# Altium project MeteoStation.PrjPcb
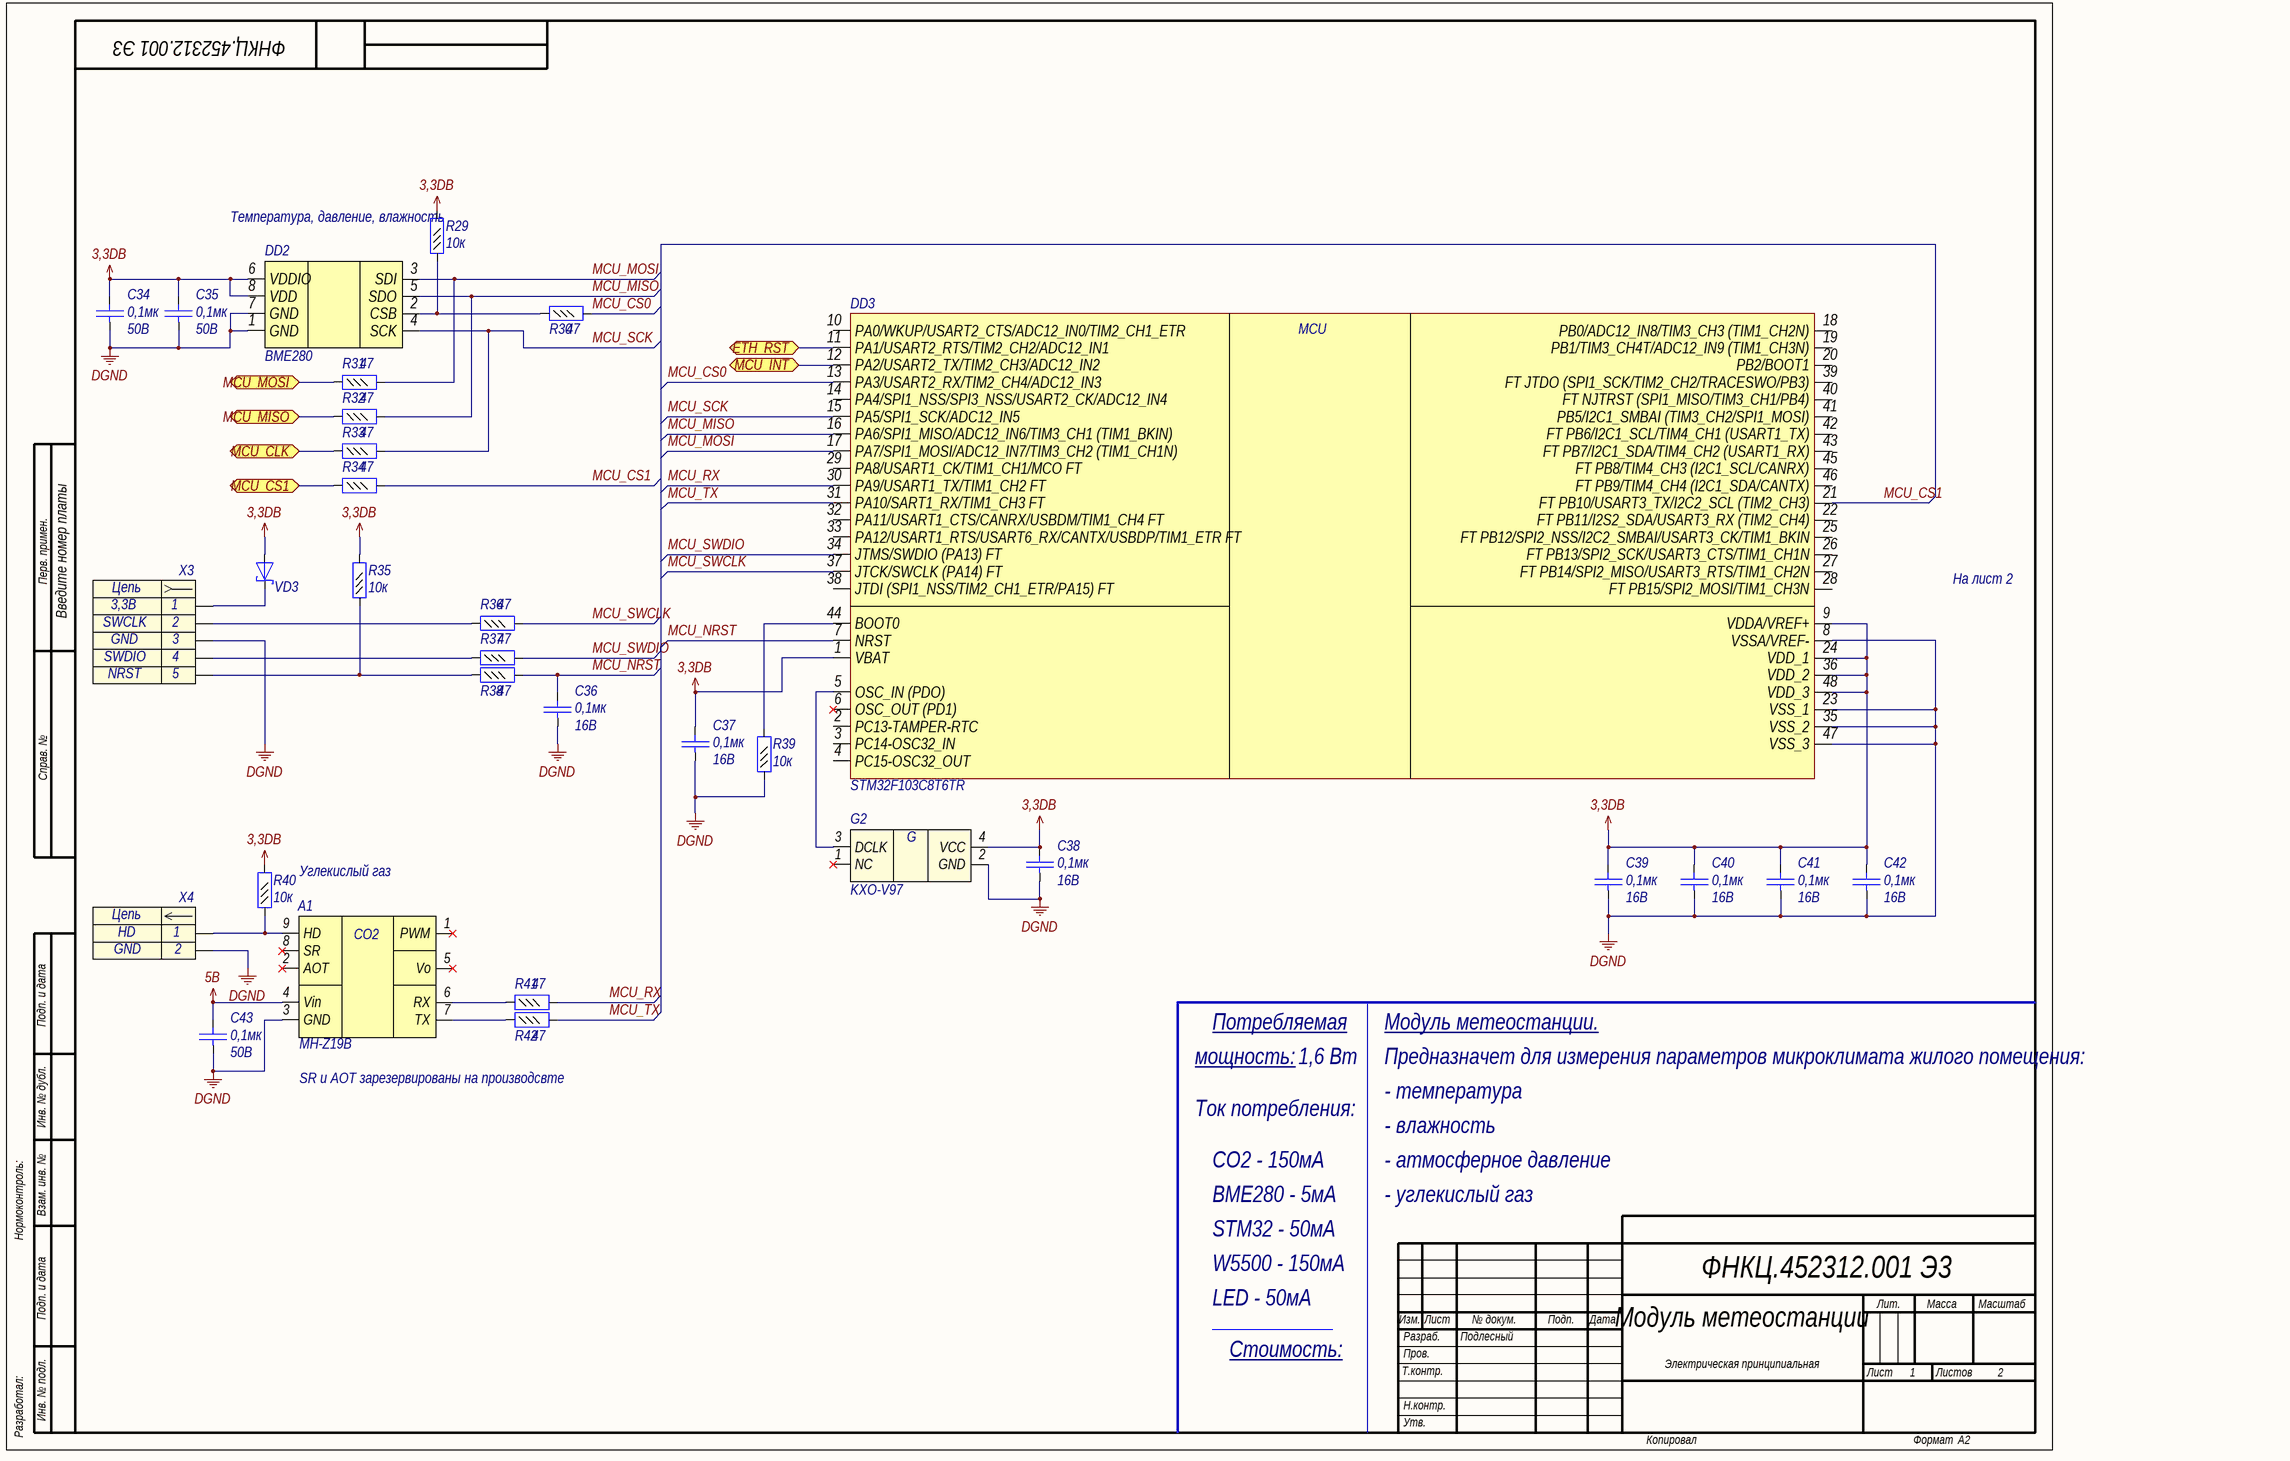
[diagram p0: MeteoStation_MCU.SchDoc]
2 sheets, 108 parts. Net scope: flat (ports and power ports of the same name join across sheets).
Board file: MeteoStation.PcbDoc
Sheets:
  MeteoStation_MCU.SchDoc
  MeteoStation_ETH.SchDoc

## Sheet MeteoStation_MCU.SchDoc: Модуль метеостанции
size 594 x 420 mm; DrawnBy: Подлесный; DocumentNumber: ФНКЦ.452312.001 Э3; SheetNumber: 1; SheetTotal: 2; Format: A2; DocumentType: Электрическая принципиальная; ImagePath: Введите номер платы

### Parts
A1  MH-Z19B  [MH-Z19B]
C34  value 0,1мк  Voltage: 50B  [C0603]  (hidden comment: Capacitor)
C35  value 0,1мк  Voltage: 50B  [C0603]  (hidden comment: Capacitor)
C36  value 0,1мк  Voltage: 16B  [C0402]  (hidden comment: Capacitor)
C37  value 0,1мк  Voltage: 16B  [C0402]  (hidden comment: Capacitor)
C38  value 0,1мк  Voltage: 16B  [C0402]  (hidden comment: Capacitor)
C39  value 0,1мк  Voltage: 16B  [C0402]  (hidden comment: Capacitor)
C40  value 0,1мк  Voltage: 16B  [C0402]  (hidden comment: Capacitor)
C41  value 0,1мк  Voltage: 16B  [C0402]  (hidden comment: Capacitor)
C42  value 0,1мк  Voltage: 16B  [C0402]  (hidden comment: Capacitor)
C43  value 0,1мк  Voltage: 50B  [C0603]  (hidden comment: Capacitor)
DD2  BME280  [BME280]
DD3  STM32F103C8T6TR  [LQFP48]
G2  Part Number: KXO-V97  [QSMD7x5.2x1.8]  (hidden comment: KXO)
R29  value 10к  [R0402]  (hidden comment: Resistor_0,062Вт)
R30  value 47  [R0402]  (hidden comment: Resistor_0,062Вт)
R31  value 47  [R0402]  (hidden comment: Resistor_0,062Вт)
R32  value 47  [R0402]  (hidden comment: Resistor_0,062Вт)
R33  value 47  [R0402]  (hidden comment: Resistor_0,062Вт)
R34  value 47  [R0402]  (hidden comment: Resistor_0,062Вт)
R35  value 10к  [R0402]  (hidden comment: Resistor_0,062Вт)
R36  value 47  [R0402]  (hidden comment: Resistor_0,062Вт)
R37  value 47  [R0402]  (hidden comment: Resistor_0,062Вт)
R38  value 47  [R0402]  (hidden comment: Resistor_0,062Вт)
R39  value 10к  [R0402]  (hidden comment: Resistor_0,062Вт)
R40  value 10к  [R0402]  (hidden comment: Resistor_0,062Вт)
R41  value 47  [R0402]  (hidden comment: Resistor_0,062Вт)
R42  value 47  [R0402]  (hidden comment: Resistor_0,062Вт)
VD3  DiodeSchottky  [SOD-323]  (value not drawn)
X3  Header_5_sct  [53047-0510]  (value not drawn)
X4  (no value)  [JUMPER_2.54]

### Ports
ETH_RST, MCU_CLK, MCU_CS1, MCU_INT, MCU_MISO, MCU_MOSI

### Nets
3,3DB: C34.2 C35.2 C37.2 C38.2 C39.2 C40.2 C41.2 C42.2 DD2.6(VDDIO) DD2.8(VDD) DD3.1(VBAT) DD3.9(VDDA/VREF+) DD3.24(VDD_1) DD3.36(VDD_2) DD3.48(VDD_3) G2.4(VCC) R29.2 R35.2 R40.2 VD3.2(A)
5B: A1.4(Vin) C43.2
DGND: A1.3(GND) C34.1 C35.1 C36.1 C37.1 C38.1 C39.1 C40.1 C41.1 C42.1 C43.1 DD2.1(GND) DD2.7(GND) DD3.8(VSSA/VREF-) DD3.23(VSS_1) DD3.35(VSS_2) DD3.47(VSS_3) G2.2(GND) R39.1 X3.3 X4.2
MCU_CS0: DD3.13(PA3/USART2_RX/TIM2_CH4/ADC12_IN3) R30.2
MCU_CS1: DD3.21(FT_PB10/USART3_TX/I2C2_SCL_(TIM2_CH3)) R34.2
MCU_MISO: DD2.5(SDO) DD3.16(PA6/SPI1_MISO/ADC12_IN6/TIM3_CH1_(TIM1_BKIN)) R32.2
MCU_MOSI: DD2.3(SDI) DD3.17(PA7/SPI1_MOSI/ADC12_IN7/TIM3_CH2_(TIM1_CH1N)) R31.2
MCU_NRST: C36.2 DD3.7(NRST) R38.2
MCU_RX: DD3.30(PA9/USART1_TX/TIM1_CH2_FT) R41.2
MCU_SCK: DD2.4(SCK) DD3.15(PA5/SPI1_SCK/ADC12_IN5) R33.2
MCU_SWCLK: DD3.37(JTCK/SWCLK_(PA14)_FT) R36.2
MCU_SWDIO: DD3.34(JTMS/SWDIO_(PA13)_FT) R37.2
MCU_TX: DD3.31(PA10/SART1_RX/TIM1_CH3_FT) R42.2
NetA1_6: A1.6(RX) R41.1
NetA1_7: A1.7(TX) R42.1
NetA1_9: A1.9(HD) R40.1 X4.1
NetDD1_32: R34.1 ; port MCU_CS1
NetDD1_33: R33.1 ; port MCU_CLK
NetDD1_34: R32.1 ; port MCU_MISO
NetDD1_35: R31.1 ; port MCU_MOSI
NetDD2_2: DD2.2(CSB) R29.1 R30.1
NetDD3_5: DD3.5(OSC_IN_(PDO)) G2.3(DCLK)
NetDD3_11: DD3.11(PA1/USART2_RTS/TIM2_CH2/ADC12_IN1) ; port ETH_RST
NetDD3_12: DD3.12(PA2/USART2_TX/TIM2_CH3/ADC12_IN2) ; port MCU_INT
NetDD3_44: DD3.44(BOOT0) R39.2
NetR35_1: R35.1 R38.1 X3.5
NetR36_1: R36.1 X3.2
NetR37_1: R37.1 X3.4
NetVD3_1: VD3.1(K) X3.1

Not connected (* = marked no-connect by the designer): A1 1(PWM)* 2(AOT)* 5(Vo)* 8(SR)*; DD3 2(PC13-TAMPER-RTC) 3(PC14-OSC32_IN) 4(PC15-OSC32_OUT) 6(OSC_OUT_(PD1))* 10(PA0/WKUP/USART2_CTS/ADC12_IN0/TIM2_CH1_ETR) 14(PA4/SPI1_NSS/SPI3_NSS/USART2_CK/ADC12_IN4) 18(PB0/ADC12_IN8/TIM3_CH3_(TIM1_CH2N)) 19(PB1/TIM3_CH4T/ADC12_IN9_(TIM1_CH3N)) 20(PB2/BOOT1) 22(FT_PB11/I2S2_SDA/USART3_RX_(TIM2_CH4)) 25(FT_PB12/SPI2_NSS/I2C2_SMBAI/USART3_CK/TIM1_BKIN) 26(FT_PB13/SPI2_SCK/USART3_CTS/TIM1_CH1N) 27(FT_PB14/SPI2_MISO/USART3_RTS/TIM1_CH2N) 28(FT_PB15/SPI2_MOSI/TIM1_CH3N) 29(PA8/USART1_CK/TIM1_CH1/MCO_FT) 32(PA11/USART1_CTS/CANRX/USBDM/TIM1_CH4_FT) 33(PA12/USART1_RTS/USART6_RX/CANTX/USBDP/TIM1_ETR_FT) 38(JTDI_(SPI1_NSS/TIM2_CH1_ETR/PA15)_FT) 39(FT_JTDO_(SPI1_SCK/TIM2_CH2/TRACESWO/PB3)) 40(FT_NJTRST_(SPI1_MISO/TIM3_CH1/PB4)) 41(PB5/I2C1_SMBAI_(TIM3_CH2/SPI1_MOSI)) 42(FT_PB6/I2C1_SCL/TIM4_CH1_(USART1_TX)) 43(FT_PB7/I2C1_SDA/TIM4_CH2_(USART1_RX)) 45(FT_PB8/TIM4_CH3_(I2C1_SCL/CANRX)) 46(FT_PB9/TIM4_CH4_(I2C1_SDA/CANTX)); G2 1(NC)*

### Notes on the sheet
- (near R29) Температура, давление, влажность
- Перв. примен.
- На лист 2
- Справ. №
- Углекислый газ
- Подп. и дата
- мощность:
- Потребляемая
- 1,6 Вт
- Модуль метеостанции.
- Предназначет для измерения параметров микроклимата жилого помещения:
- Инв. № дубл.
- SR и AOT зарезервированы на производсвте
- - температура
- Ток потребления:
- - влажность
- Нормоконтроль:
- Взам. инв. №
- СО2 - 150мА
- BME280 - 5мА
- - атмосферное давление
- - углекислый газ
- STM32 - 50мА
- W5500 - 150мА
- LED - 50мА
- Изм.
- Лист
- № докум.
- Подп.
- Дата
- Лит.
- Масса
- Масштаб
- Стоимость:
- Т.контр.
- Пров.
- Разраб.
- Листов
- Разработал:
- Инв. № подл.
- Н.контр.
- Утв.
- Копировал
- Формат
- (in symbol connect54) Цепь
- (in symbol connect55) Цепь
- (in symbol crystal10) G
- (in symbol MH-Z19B) CO2
- (in symbol microcont0) MСU

### Library data of the parts
A1 = MH-Z19B: Part Name: Intelligent Infrared CO2 Module; Manufacture: Winsen; id: sensor3; Type sensor: СО2; Interface: PWM, UART; Part Number: MH-Z19B
C34 C35 C43 = cap131: Конденсатор; Part Name: Ceramic; Manufacture: Murata; Part Number: GRM188R71H104KA93D; id: cap131; TKE: X7R
C36-C42 = cap49: Конденсатор; Part Name: Ceramic; Manufacture: Murata; Part Number: GRM155R71C104KA88D; id: cap49; TKE: X7R
DD2 = BME280: Part Name: Digital Pressure Sensor; Manufacture: Bosch; id: sensor1; Type sensor: Humidity, Pressure, Temperature; Interface: I2C,SPI; Part Number: BME280
DD3 = microcont0: Medium-density performance line ARM®-based 32-bit MCU with 64  or 128 KB Flash, USB, CAN, 7 timers, 2 ADCs, 9 com. interfaces; Part Name: Microcontroller; Frequency: 72MHz; ADC: 10x12b; Interface: can, i2c, irda, lin, spi, uart, usb; Flash: 64kb; Pin in: 37; Power Supply: 2.0-3.6 V; id: microcont0; Part Number: STM32F103C8T6TR
G2 = crystal10: Кварц. генер. 32.768 МГц (HCMOS/TTL); Manufacture: GEYER; Frequence: 12MHz; id: crystal10
R29 R35 R39 R40 = res290: Резистор; Manufacture: Yageo; Part Number: RC0402FR-0710KL; id: res290; Accuracy: 0,01; Part Name: Resistor; Power: 0,062Вт
R30-R34 R36-R38 R41 R42 = res234: Резистор; Manufacture: Yageo; Part Number: RC0402FR-0747RL; id: res234; Accuracy: 0,01; Part Name: Resistor; Power: 0,062Вт
VD3 = diode19: Диод Шоттки; Part Number: PMEG4010BEA.115; Manufacture: NXP Semiconductor; Max Reverse Voltage: 40B; Forward Voltage: 0,64B; Forward Current: 10mA; Capacitance: 50pF; Number of Channels: 1; id: diode19; Part Name: Diode Schottky
X3 = connect55: Разъем - 5 конт. розетка; Part Name: 1.25mm Pitch PicoBlade; Manufacture: Molex; Contact_1: 3,3В; Contact_2: SWCLK; Contact_3: GND; Contact_4: SWDIO; Contact_5: NRST; Etch: 1,25mm; id: connect55; Part Number: 53047-0510
X4 = connect54: Разъем - 2 конт. вилка; Part Name: Jumper 2,54mm; Contact_1: HD; Contact_2: GND; Etch: 2,54mm; id: connect54

## Sheet MeteoStation_ETH.SchDoc
size 594 x 420 mm; DocumentNumber: ФНКЦ.452312.001 Э3; SheetNumber: 2; Format: A2
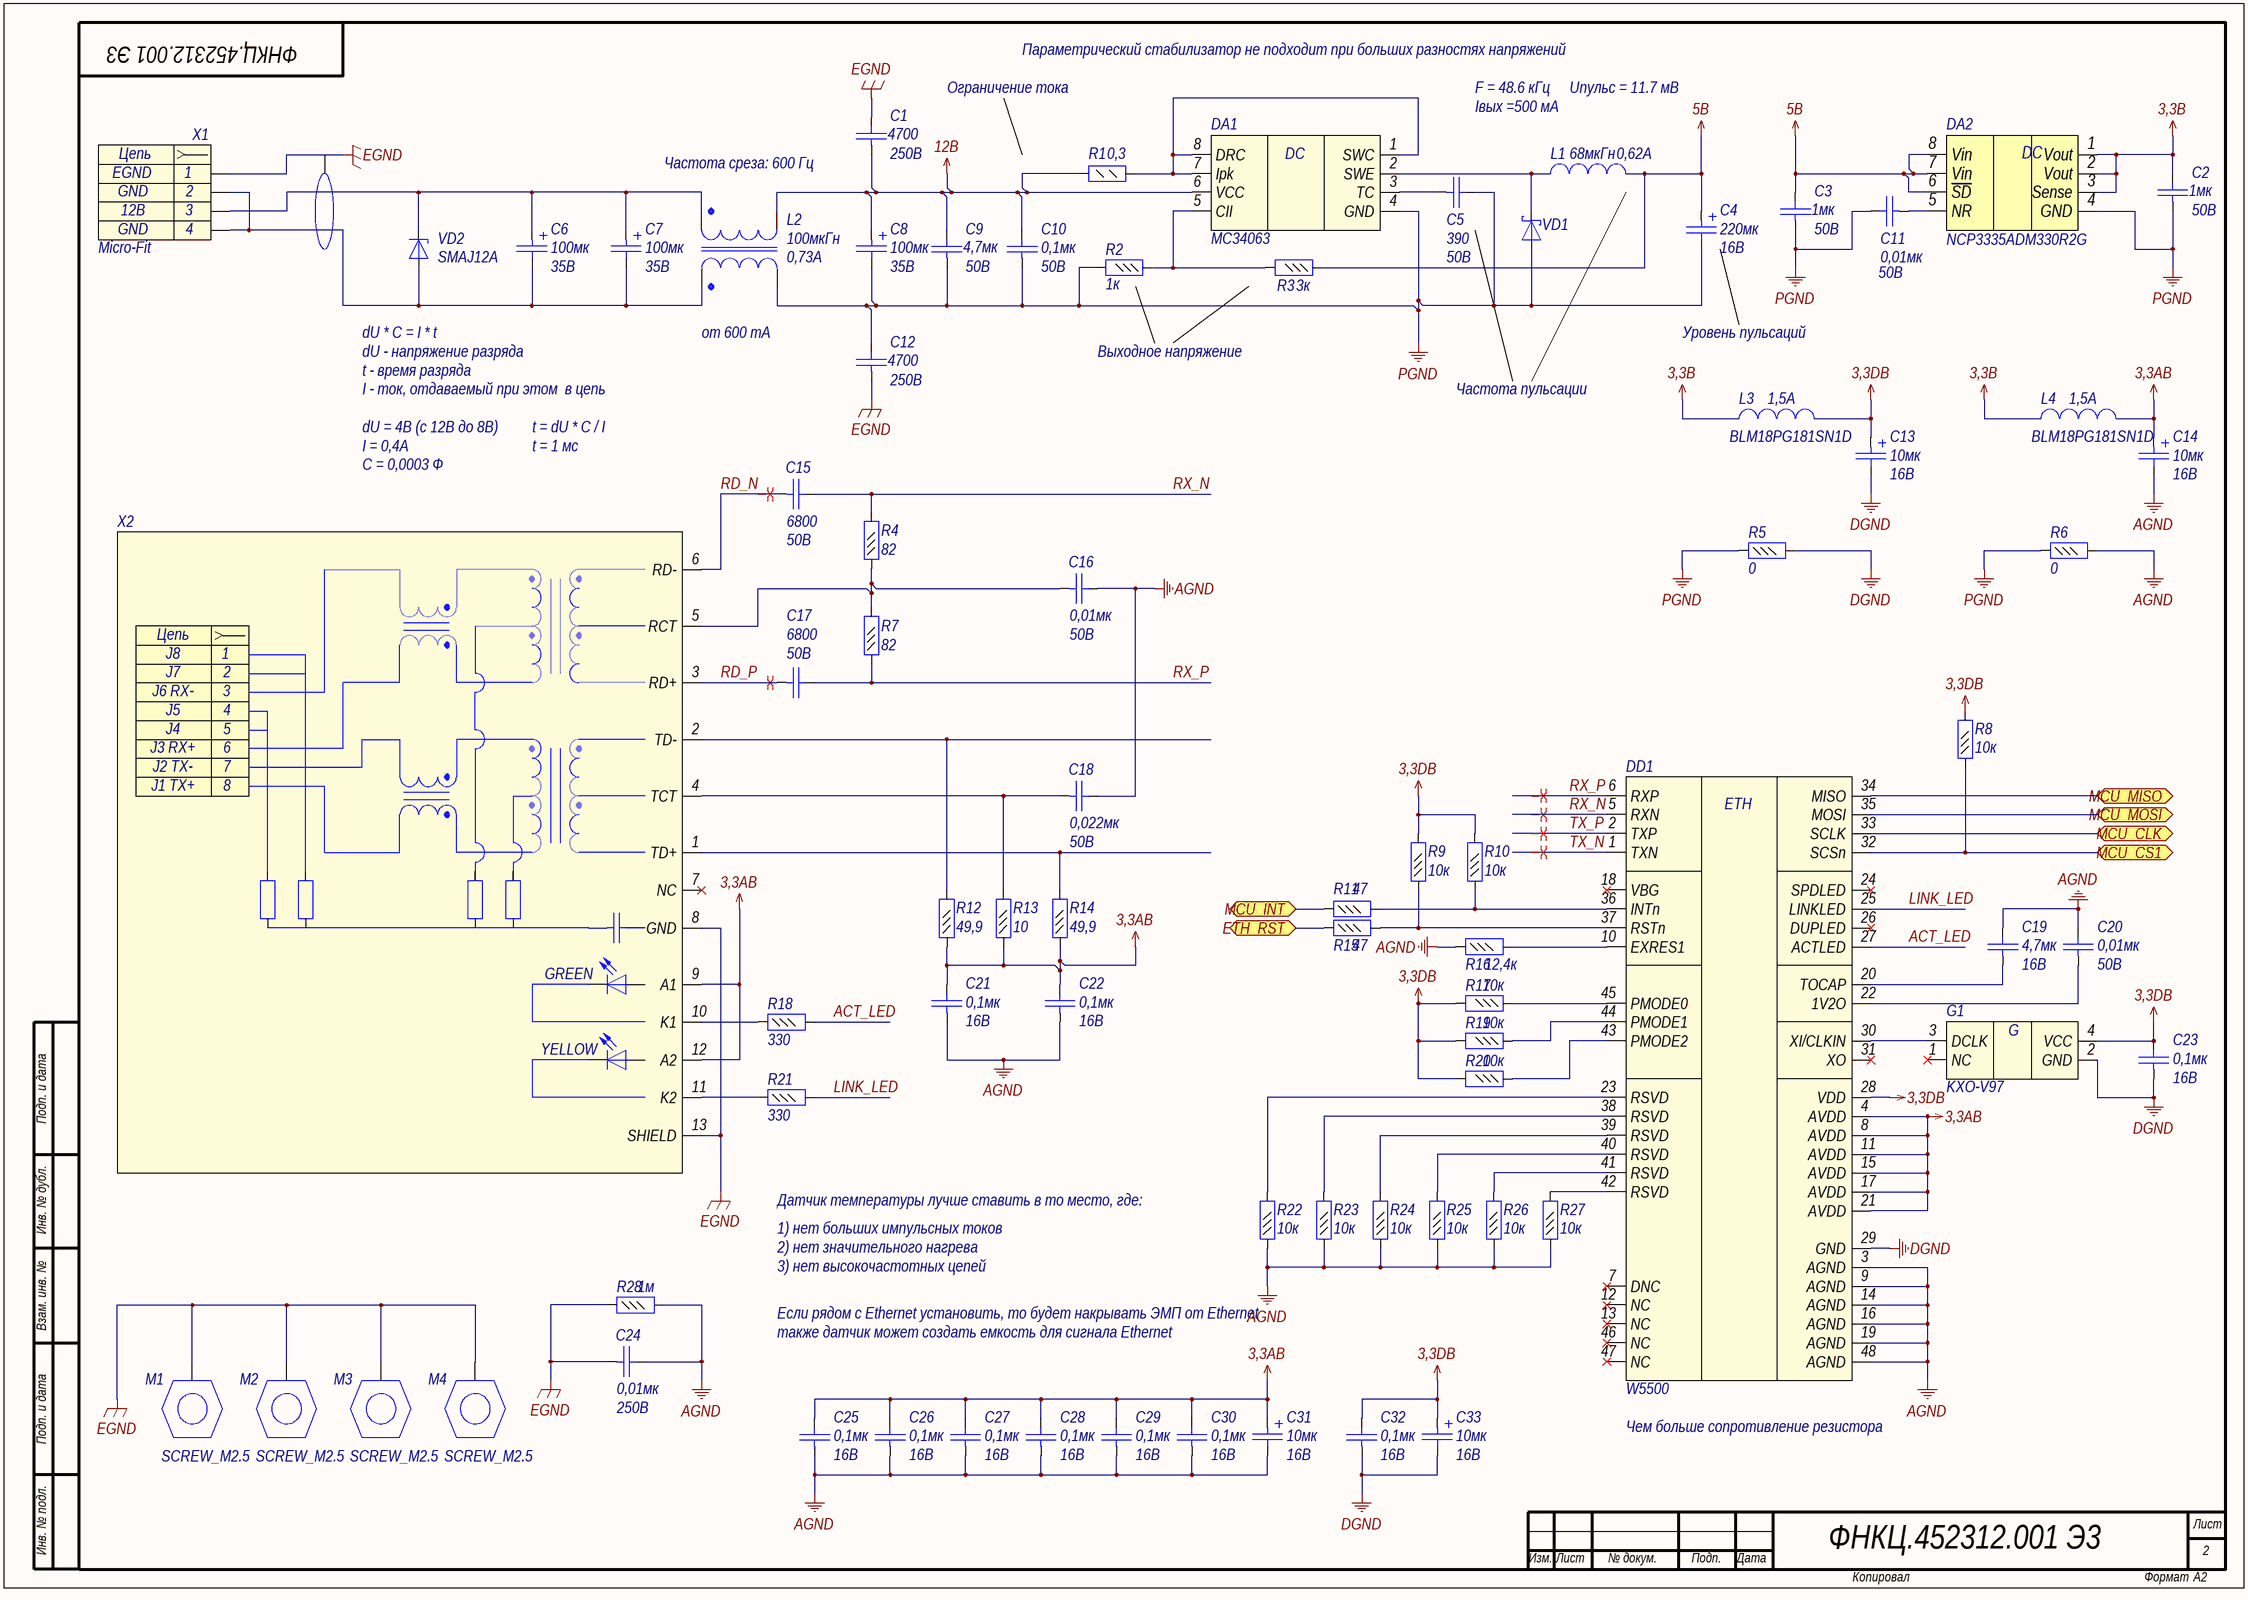
[diagram p1: MeteoStation_ETH.SchDoc]

### Parts
C1  value 4700  Voltage: 250В  [C0805]  (hidden comment: Capacitor)
C2  value 1мк  Voltage: 50B  [C0603]  (hidden comment: Capacitor)
C3  value 1мк  Voltage: 50B  [C0603]  (hidden comment: Capacitor)
C4  value 220мк  Voltage: 16В  [K50-35(6.3X11)_MIRROR]  (hidden comment: Capacitor_pol)
C5  value 390  Voltage: 50B  [C0603]  (hidden comment: Capacitor)
C6  value 100мк  Voltage: 35В  [K50-35(6.3X11)]  (hidden comment: Capacitor_pol)
C7  value 100мк  Voltage: 35В  [K50-35(6.3X11)]  (hidden comment: Capacitor_pol)
C8  value 100мк  Voltage: 35В  [K50-35(6.3X11)_MIRROR]  (hidden comment: Capacitor_pol)
C9  value 4,7мк  Voltage: 50В  [C1206]  (hidden comment: Capacitor)
C10  value 0,1мк  Voltage: 50B  [C0603]  (hidden comment: Capacitor)
C11  value 0,01мк  Voltage: 50B  [C0603]  (hidden comment: Capacitor)
C12  value 4700  Voltage: 250В  [C0805]  (hidden comment: Capacitor)
C13  value 10мк  Voltage: 16В  [TANTAL CASE A]  (hidden comment: Capacitor_pol)
C14  value 10мк  Voltage: 16В  [TANTAL CASE A]  (hidden comment: Capacitor_pol)
C15  value 6800  Voltage: 50B  [C0603]  (hidden comment: Capacitor)
C16  value 0,01мк  Voltage: 50B  [C0402]  (hidden comment: Capacitor)
C17  value 6800  Voltage: 50B  [C0603]  (hidden comment: Capacitor)
C18  value 0,022мк  Voltage: 50B  [C0402]  (hidden comment: Capacitor)
C19  value 4,7мк  Voltage: 16В  [C0805]  (hidden comment: Capacitor)
C20  value 0,01мк  Voltage: 50B  [C0402]  (hidden comment: Capacitor)
C21  value 0,1мк  Voltage: 16B  [C0402]  (hidden comment: Capacitor)
C22  value 0,1мк  Voltage: 16B  [C0402]  (hidden comment: Capacitor)
C23  value 0,1мк  Voltage: 16B  [C0402]  (hidden comment: Capacitor)
C24  value 0,01мк  Voltage: 250В  [C0805]  (hidden comment: Capacitor)
C25  value 0,1мк  Voltage: 16B  [C0402]  (hidden comment: Capacitor)
C26  value 0,1мк  Voltage: 16B  [C0402]  (hidden comment: Capacitor)
C27  value 0,1мк  Voltage: 16B  [C0402]  (hidden comment: Capacitor)
C28  value 0,1мк  Voltage: 16B  [C0402]  (hidden comment: Capacitor)
C29  value 0,1мк  Voltage: 16B  [C0402]  (hidden comment: Capacitor)
C30  value 0,1мк  Voltage: 16B  [C0402]  (hidden comment: Capacitor)
C31  value 10мк  Voltage: 16В  [TANTAL CASE A]  (hidden comment: Capacitor_pol)
C32  value 0,1мк  Voltage: 16B  [C0402]  (hidden comment: Capacitor)
C33  value 10мк  Voltage: 16В  [TANTAL CASE A]  (hidden comment: Capacitor_pol)
DA1  MC34063  [SO8]
DA2  NCP3335ADM330R2G  [MICRO8]
DD1  (no value)  [LQFP48]
G1  Part Number: KXO-V97  [QSMD7x5.2x1.8]  (hidden comment: KXO)
L1  value 68мкГн  Rated Current: 0,62A  [SDR0604]  (hidden comment: Inductor)
L2  value 100мкГн  Rated Current: 0,73A  [SRF0703]  (hidden comment: Dual-Winding Inductor)
L3  Rated Current: 1,5A  Part Number: BLM18PG181SN1D  [L0603]  (hidden comment: Inductor)
L4  Rated Current: 1,5A  Part Number: BLM18PG181SN1D  [L0603]  (hidden comment: Inductor)
M1  SCREW_M2.5  [HOLE2.5]
M2  SCREW_M2.5  [HOLE2.5]
M3  SCREW_M2.5  [HOLE2.5]
M4  SCREW_M2.5  [HOLE2.5]
R1  value 0,3  [R0805]  (hidden comment: Resistor_0,125Вт)
R2  value 1к  [R0603]  (hidden comment: Resistor_0,062Вт)
R3  value 3к  [R0603]  (hidden comment: Resistor_0,062Вт)
R4  value 82  [R0402]  (hidden comment: Resistor_0,062Вт)
R5  value 0  [R0603]  (hidden comment: Resistor_0,062Вт)
R6  value 0  [R0603]  (hidden comment: Resistor_0,062Вт)
R7  value 82  [R0402]  (hidden comment: Resistor_0,062Вт)
R8  value 10к  [R0402]  (hidden comment: Resistor_0,062Вт)
R9  value 10к  [R0402]  (hidden comment: Resistor_0,062Вт)
R10  value 10к  [R0402]  (hidden comment: Resistor_0,062Вт)
R11  value 47  [R0402]  (hidden comment: Resistor_0,062Вт)
R12  value 49,9  [R0402]  (hidden comment: Resistor_0,062Вт)
R13  value 10  [R0402]  (hidden comment: Resistor_0,062Вт)
R14  value 49,9  [R0402]  (hidden comment: Resistor_0,062Вт)
R15  value 47  [R0402]  (hidden comment: Resistor_0,062Вт)
R16  value 12,4к  [R0603]  (hidden comment: Resistor_0,062Вт)
R17  value 10к  [R0402]  (hidden comment: Resistor_0,062Вт)
R18  value 330  [R0402]  (hidden comment: Resistor_0,062Вт)
R19  value 10к  [R0402]  (hidden comment: Resistor_0,062Вт)
R20  value 10к  [R0402]  (hidden comment: Resistor_0,062Вт)
R21  value 330  [R0402]  (hidden comment: Resistor_0,062Вт)
R22  value 10к  [R0402]  (hidden comment: Resistor_0,062Вт)
R23  value 10к  [R0402]  (hidden comment: Resistor_0,062Вт)
R24  value 10к  [R0402]  (hidden comment: Resistor_0,062Вт)
R25  value 10к  [R0402]  (hidden comment: Resistor_0,062Вт)
R26  value 10к  [R0402]  (hidden comment: Resistor_0,062Вт)
R27  value 10к  [R0402]  (hidden comment: Resistor_0,062Вт)
R28  value 1м  [R0603]  (hidden comment: Resistor_0,062Вт)
VD1  DiodeSchottky  [SOD-323]  (value not drawn)
VD2  Part Number: SMAJ12A  [SMA]  (hidden comment: DiodeZener)
X1  Micro-Fit  [43045-0400]
X2  HR911105A  [RJ45_HANRUN]  (value not drawn)

### Ports
ETH_RST, MCU_CLK, MCU_CS1, MCU_INT, MCU_MISO, MCU_MOSI

### Nets
3,3AB: C14.1 C21.2 C22.2 C25.2 C26.2 C27.2 C28.2 C29.2 C30.2 C31.1 DD1.4(AVDD) DD1.8(AVDD) DD1.11(AVDD) DD1.15(AVDD) DD1.17(AVDD) DD1.21(AVDD) L4.2 R12.1 R13.1 R14.1 X2.9(A1) X2.12(A2)
3,3B: C2.2 DA2.1(Vout) DA2.2(Vout) DA2.3(Sense) L3.1 L4.1
3,3DB: C13.1 C23.2 C32.2 C33.1 DD1.28(VDD) G1.4(VCC) L3.2 R8.2 R9.2 R10.2 R17.2 R19.2 R20.2
5B: C3.2 C4.1 DA2.6(~{SD}) DA2.7(Vin) DA2.8(Vin) L1.2 R3.1
12B: C1.1 C8.1 C9.2 C10.2 DA1.6(VCC) L2.4 R1.1
AGND: C14.2 C16.2 C18.2 C19.2 C20.2 C21.1 C22.1 C24.2 C25.1 C26.1 C27.1 C28.1 C29.1 C30.1 C31.2 DD1.3(AGND) DD1.9(AGND) DD1.14(AGND) DD1.16(AGND) DD1.19(AGND) DD1.48(AGND) R6.2 R16.1 R22.1 R23.1 R24.1 R25.1 R26.1 R27.1 R28.2
DGND: C13.2 C23.1 C32.1 C33.2 DD1.29(GND) G1.2(GND) R5.2
EGND: C1.2 C12.1 C24.1 M1.1 M2.1 M3.1 M4.1 R28.1 X1.1 X2.8(GND) X2.13(SHIELD)
PGND: C2.1 C3.1 C4.2 C5.2 C8.2 C9.1 C10.1 C11.2 C12.2 DA1.4(GND) DA2.4(GND) L2.3 R2.2 R5.1 R6.1 VD1.2(A)
ACT_LED: DD1.27(ACTLED) R18.2
LINK_LED: DD1.25(LINKLED) R21.2
RD_N: C15.1 X2.6(RD-)
RD_P: C17.1 X2.3(RD+)
RX_N: C15.2 DD1.5(RXN) R4.2
RX_P: C17.2 DD1.6(RXP) R7.1
TX_N: DD1.1(TXN)
TX_P: DD1.2(TXP)
NetC5_1: C5.1 DA1.3(TC)
NetC6_1: C6.1 C7.1 L2.2 VD2.1(K) X1.3
NetC6_2: C6.2 C7.2 L2.1 VD2.2(A) X1.2 X1.4
NetC11_1: C11.1 DA2.5(NR)
NetC16_1: C16.1 R4.1 R7.2 X2.5(RCT)
NetC18_1: C18.1 R13.2 X2.4(TCT)
NetC19_1: C19.1 DD1.20(TOCAP)
NetC20_1: C20.1 DD1.22(1V2O)
NetDA1_1: DA1.1(SWC) DA1.7(Ipk) DA1.8(DRC) R1.2
NetDA1_2: DA1.2(SWE) L1.1 VD1.1(K)
NetDA1_5: DA1.5(CII) R2.1 R3.2
NetDD1_10: DD1.10(EXRES1) R16.2
NetDD1_23: DD1.23(RSVD) R22.2
NetDD1_30: DD1.30(XI/CLKIN) G1.3(DCLK)
NetDD1_32: DD1.32(SCSn) R8.1 ; port MCU_CS1
NetDD1_33: DD1.33(SCLK) ; port MCU_CLK
NetDD1_34: DD1.34(MISO) ; port MCU_MISO
NetDD1_35: DD1.35(MOSI) ; port MCU_MOSI
NetDD1_36: DD1.36(INTn) R10.1 R11.2
NetDD1_37: DD1.37(RSTn) R9.1 R15.2
NetDD1_38: DD1.38(RSVD) R23.2
NetDD1_39: DD1.39(RSVD) R24.2
NetDD1_40: DD1.40(RSVD) R25.2
NetDD1_41: DD1.41(RSVD) R26.2
NetDD1_42: DD1.42(RSVD) R27.2
NetDD1_43: DD1.43(PMODE2) R20.1
NetDD1_44: DD1.44(PMODE1) R19.1
NetDD1_45: DD1.45(PMODE0) R17.1
NetDD3_11: R15.1 ; port ETH_RST
NetDD3_12: R11.1 ; port MCU_INT
NetR12_2: R12.2 X2.2(TD-)
NetR14_2: R14.2 X2.1(TD+)
NetR18_1: R18.1 X2.10(K1)
NetR21_1: R21.1 X2.11(K2)

Not connected (* = marked no-connect by the designer): DD1 7(DNC)* 12(NC)* 13(NC)* 18(VBG)* 24(SPDLED)* 26(DUPLED)* 31(XO)* 46(NC)* 47(NC)*; G1 1(NC)*; X2 7(NC)*

### Layout directives
differential pair: RD_N, RD_P, RX_N, RX_P, TX_N, TX_P

### Notes on the sheet
- Параметрический стабилизатор не подходит при больших разностях напряжений
- Ограничение тока
- F = 48.6 кГц
- Iвых =500 мА
- Uпульс = 11.7 мВ
- (near C1) Частота среза: 600 Гц
- dU * C = I * t
- dU - напряжение разряда
- от 600 mA
- Выходное напряжение
- Уровень пульсаций
- t - время разряда
- I - ток, отдаваемый при этом  в цепь
- Частота пульсации
- dU = 4В (с 12В до 8В)
- I = 0,4А
- t = dU * C / I
- t = 1 мс
- С = 0,0003 Ф
- Подп. и дата
- Инв. № дубл.
- Датчик температуры лучше ставить в то место, где:
- 1) нет больших импульсных токов
- 2) нет значительного нагрева
- Взам. инв. №
- 3) нет высокочастотных цепей
- Если рядом с Ethernet установить, то будет накрывать ЭМП от Ethernet
- также датчик может создать емкость для сигнала Ethernet
- Чем больше сопротивление резистора
- Инв. № подл.
- Лист
- Изм.
- № докум.
- Подп.
- Дата
- Копировал
- Формат
- (in symbol connect51) Цепь
- (in symbol connect52) Цепь; J8; J7; J6 RX-; J5; J4; J3 RX+; J2 TX-; J1 TX+; GREEN; YELLOW
- (in symbol crystal9) G
- (in symbol interf19) ETH
- (in symbol pwr16) DC
- (in symbol pwr21) DC

### Library data of the parts
C1 C12 = cap170: Конденсатор; Part Name: Ceramic; Manufacture: Murata; Part Number: GRM21AR72E472KW; id: cap170; TKE: X7R
C2 C3 = cap133: Конденсатор; Part Name: Ceramic; Manufacture: Murata; Part Number: GRM188R71C105KA12D**; id: cap133; TKE: X7R
C4 = cap230: Конденсатор полярный; Part Name: Electrolit; Manufacture: Jamicon; Part Number: TKR221M1CE11; id: cap230; tga: 0,20%
C5 = cap99: Конденсатор; Part Name: Ceramic; Manufacture: Murata; Part Number: GRM1885C1H391J; id: cap99; TKE: NP0
C6 C7 = cap226: Конденсатор полярный; Part Name: Electrolit; Manufacture: Jamicon; Part Number: TKR101M1VE11; id: cap226; tga: 0,20%
C8 = cap225: Конденсатор полярный; Part Name: Electrolit; Manufacture: Jamicon; Part Number: TKR101M1VE11; id: cap225; tga: 0,20%
C9 = cap188: Конденсатор; Part Name: Ceramic; Manufacture: Murata; Part Number: GRM31CR71H475KA12L; id: cap188; TKE: X7R
C10 = cap131: as C34 on sheet MeteoStation_MCU
C11 = cap124: Конденсатор; Part Name: Ceramic; Manufacture: Murata; Part Number: GRM188R71H103K; id: cap124; TKE: X7R
C13 C14 C31 C33 = cap199: Конденсатор полярный; Part Name: Tantal; Manufacture: Vishay; Part Number: 293D106X9016A2TE3; id: cap199
C15 C17 = cap122: Конденсатор; Part Name: Ceramic; Manufacture: Murata; Part Number: GRM188R71H682K; id: cap122; TKE: X7R
C16 C20 = cap42: Конденсатор; Part Name: Ceramic; Manufacture: Murata; Part Number: GRM155R71H103K; id: cap42; TKE: X7R
C18 = cap43: Конденсатор; Part Name: Ceramic; Manufacture: Murata; Part Number: GRM155R71H223K; id: cap43; TKE: X7R
C19 = cap234: Конденсатор; Part Name: Ceramic; Manufacture: Murata; Part Number: GRM21BR71C475KA73L; id: cap234; TKE: X7R
C21-C23 C25-C30 C32 = cap49: as C36 on sheet MeteoStation_MCU
C24 = cap135: Конденсатор; Part Name: Ceramic; Manufacture: Murata; Part Number: GRM21BR72E103K; id: cap135; TKE: X7R
DA1 = pwr21: 1.5 A, Step-Up/Down/  Inverting Switching  Regulators; Part Number: MC34063ADR2G; Manufacturer: ON Semiconductor; id: pwr21; Input Voltage: 3-40B; Output Voltage: Adj; Current: 1,5A; Part Name: 1.5 A, Step-Up/Down/ Inverting Switching Regulators; Type: Impulse
DA2 = pwr16: Линейный стабилизатор напряжения, фиксированный выход; Part Name: Low-Dropout Linear Regulator 2 outputs; Manufacturer: ON Semiconductor; id: pwr16; Input Voltage: 16B; Output Voltage: 3,3B; Current: 800mA; Type: Linear; Part Number: NCP3335ADM330R2G
DD1 = interf19: Ethernet - SPI; Manufacture: WIZnet; Type Supply: Single Polar; Current Consumption: 132mA; Power Supply: 2.97-3.63V; id: interf19; Part Name: ETHERNET - SPI; Part Number: W5500
G1 = crystal9: Кварц. генер. 32.768 МГц (HCMOS/TTL); Manufacture: GEYER; Frequence: 25MHz; id: crystal9
L1 = ind52: EMI Suppression Filter; Part Name: SMD Power Inductors; Part Number: SDR0604- 680KL; Manufacture: Bourns; id: ind52; Saturation Current: 0,84A; Resistance: 0,52Ohm
L2 = ind24: Синфазный дроссель; Part Name: Dual-Winding Shielded Power Inductors; Part Number: SRF0703-101M; Manufacture: Bourns; id: ind24; Saturation Current: 0,79A; Resistance: 0,715Ohm
L3 L4 = ind0: EMI Suppression Filter; Part Name: EMI Suppression Filters; id: ind0; Resistance: 0,09Ohm
M1-M4 = connect53: Part Name: Винт М2.5 с заземлением; id: connect53
R1 = res982: Резистор; Manufacture: Yageo; Part Number: RC0805FR-0749R9L; id: res982; Accuracy: 0,01; Part Name: Resistor; Power: 0,125Вт
R2 = res459: Резистор; Manufacture: Yageo; Part Number: RC0603FR-071KL; id: res459; Accuracy: 0,01; Part Name: Resistor; Power: 0,062Вт
R3 = res470: Резистор; Manufacture: Yageo; Part Number: RC0603FR-073KL; id: res470; Accuracy: 0,01; Part Name: Resistor; Power: 0,062Вт
R4 R7 = res240: Резистор; Manufacture: Yageo; Part Number: RC0402FR-0782RL; id: res240; Accuracy: 0,01; Part Name: Resistor; Power: 0,062Вт
R5 R6 = res386: Резистор; Manufacture: Yageo; Part Number: RC0603FR-070RL; id: res386; Accuracy: 0,01; Part Name: Resistor; Power: 0,062Вт
R8-R10 R17 R19 R20 R22-R27 = res290: as R29 on sheet MeteoStation_MCU; Part Name: Resistor; Power: 0,062Вт
R11 R15 = res234: as R30 on sheet MeteoStation_MCU; Part Name: Resistor; Power: 0,062Вт
R12 R14 = res979: Резистор; Manufacture: Yageo; Part Number: RC0402FR-0749R9L; id: res979; Accuracy: 0,01; Part Name: Resistor; Power: 0,062Вт
R13 = res218: Резистор; Manufacture: Yageo; Part Number: RC0402FR-0710RL; id: res218; Accuracy: 0,01; Part Name: Resistor; Power: 0,062Вт
R16 = res973: Резистор; Manufacture: Yageo; Part Number: RC0603FR-0712K4L; id: res973; Accuracy: 0,01; Part Name: Resistor; Power: 0,062Вт
R18 R21 = res254: Резистор; Manufacture: Yageo; Part Number: RC0402FR-07330RL; id: res254; Accuracy: 0,01; Part Name: Resistor; Power: 0,062Вт
R28 = res531: Резистор; Manufacture: Yageo; Part Number: RC0603FR-071ML; id: res531; Accuracy: 0,01; Part Name: Resistor; Power: 0,062Вт
VD1 = diode19: as VD3 on sheet MeteoStation_MCU; id: diode19; Part Name: Diode Schottky
VD2 = SMAJ12A: Cтабилитрон (лавинный выпрямительный диод) односторонний; Part Name: TVS diode Unidirectional; Manufacture: ST Microelectronics; id: tvs128; Leakage Current: 0,2uA; Stand-off Voltage: 12B; Breakdown Voltage: 14B; Clamping voltage: 19,9B; Dynamic resistance: 0,259Ohm; Peak Pulse Power: 400W; Number of diodes: 1
X1 = connect51: Разъем - 4 конт. розетка; Part Name: Micro-Fit 3.0 Right-Angle Header, 3.00mm Pitch; Manufacture: Molex; Contact_1: EGND; Contact_2: GND; Contact_3: 12В; Contact_4: GND; id: connect51; Part Number: 43045-0400
X2 = connect52: Разъем - 6 конт. вилка; Part Name: RJ45 connector with EMI & LEDs; Manufacture: HanRun; id: connect52; Part Number: HR911105A

## Nets that join several sheets
3,3DB: MeteoStation_MCU (20 pins), MeteoStation_ETH (13 pins)
5B: MeteoStation_MCU (A1.4 C43.2), MeteoStation_ETH (7 pins)
DGND: MeteoStation_MCU (21 pins), MeteoStation_ETH (7 pins)
NetDD1_32: MeteoStation_MCU (R34.1), MeteoStation_ETH (DD1.32 R8.1)
NetDD1_33: MeteoStation_MCU (R33.1), MeteoStation_ETH (DD1.33)
NetDD1_34: MeteoStation_MCU (R32.1), MeteoStation_ETH (DD1.34)
NetDD1_35: MeteoStation_MCU (R31.1), MeteoStation_ETH (DD1.35)
NetDD3_11: MeteoStation_MCU (DD3.11), MeteoStation_ETH (R15.1)
NetDD3_12: MeteoStation_MCU (DD3.12), MeteoStation_ETH (R11.1)